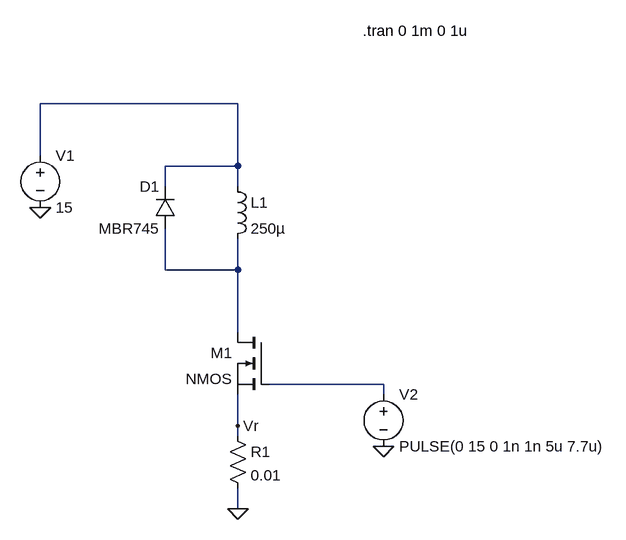
[diagram p0: schematic Draft2.asc]
Draft2.asc, the LTspice schematic file:
Version 4.1
SHEET 1 1084 680
WIRE 416 16 112 16
WIRE 112 96 112 16
WIRE 416 112 416 16
WIRE 416 112 304 112
WIRE 304 144 304 112
WIRE 416 144 416 112
WIRE 304 272 304 208
WIRE 416 272 416 224
WIRE 416 272 304 272
WIRE 416 368 416 272
WIRE 640 448 464 448
WIRE 640 464 640 448
WIRE 416 512 416 464
WIRE 416 528 416 512
WIRE 416 640 416 608
FLAG 112 176 0
FLAG 416 640 0
FLAG 640 544 0
FLAG 416 512 Vr
SYMBOL voltage 112 80 R0
WINDOW 123 0 0 Left 0
WINDOW 39 0 0 Left 0
SYMATTR InstName V1
SYMATTR Value 15
SYMBOL ind 400 128 R0
SYMATTR InstName L1
SYMATTR Value 250µ
SYMATTR SpiceLine Ipk=0.3 Rser=5 Rpar=154073 Cpar=0
SYMBOL diode 320 208 R180
WINDOW 0 24 64 Left 2
WINDOW 3 24 0 Left 2
SYMATTR InstName D1
SYMATTR Value MBR745
SYMATTR Description Diode
SYMATTR Type diode
SYMBOL res 400 512 R0
SYMATTR InstName R1
SYMATTR Value 0.01
SYMBOL nmos 464 368 M0
SYMATTR InstName M1
SYMBOL voltage 640 448 R0
WINDOW 123 0 0 Left 0
WINDOW 39 0 0 Left 0
SYMATTR InstName V2
SYMATTR Value PULSE(0 15 0 1n 1n 5u 7.7u)
TEXT 608 -96 Left 2 !.tran 0 1m 0 1u

The netlist it stands for:
* Draft2.asc
V1 N001 0 15
L1 N001 N002 250µ Ipk=0.3 Rser=5 Rpar=154073 Cpar=0
D1 N002 N001 MBR745
R1 Vr 0 0.01
M1 N002 N003 Vr Vr NMOS
V2 N003 0 PULSE(0 15 0 1n 1n 5u 7.7u)
.model D D
.lib standard.dio
.model NMOS NMOS
.model PMOS PMOS
.lib standard.mos
.tran 0 1m 0 1u
.backanno
.end